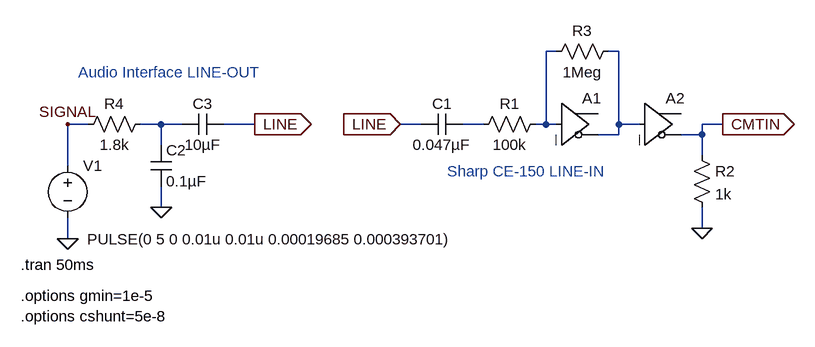
[diagram p0: schematic cd150-line-in_via_sig_gen.asc]
cd150-line-in_via_sig_gen.asc, the LTspice schematic file:
Version 4
SHEET 1 880 680
WIRE 320 -320 304 -320
WIRE 416 -320 400 -320
WIRE -400 -208 -432 -208
WIRE -288 -208 -320 -208
WIRE -256 -208 -288 -208
WIRE -144 -208 -192 -208
WIRE 112 -208 80 -208
WIRE 208 -208 176 -208
WIRE 304 -208 304 -320
WIRE 304 -208 288 -208
WIRE 320 -208 304 -208
WIRE 416 -208 416 -320
WIRE 448 -208 416 -208
WIRE 576 -208 544 -208
WIRE 416 -192 416 -208
WIRE 416 -192 384 -192
WIRE 544 -192 544 -208
WIRE 544 -192 512 -192
WIRE -288 -176 -288 -208
WIRE 544 -160 544 -192
WIRE -432 -144 -432 -208
WIRE -288 -80 -288 -112
WIRE 544 -48 544 -80
WIRE -432 -32 -432 -64
FLAG 576 -208 CMTIN
IOPIN 576 -208 Out
FLAG 80 -208 LINE
IOPIN 80 -208 In
FLAG -432 -32 0
FLAG -144 -208 LINE
IOPIN -144 -208 Out
FLAG 544 -48 0
FLAG -288 -80 0
FLAG -432 -208 SIGNAL
SYMBOL cap 176 -224 R90
WINDOW 0 0 32 VBottom 2
WINDOW 3 32 32 VTop 2
SYMATTR InstName C1
SYMATTR Value 0.047µF
SYMBOL res 304 -224 R90
WINDOW 0 0 56 VBottom 2
WINDOW 3 32 56 VTop 2
SYMATTR InstName R1
SYMATTR Value 100k
SYMBOL voltage -432 -160 R0
WINDOW 3 30 129 Left 2
WINDOW 123 0 0 Left 0
WINDOW 39 0 0 Left 0
SYMATTR InstName V1
SYMATTR Value PULSE(0 5 0 0.01u 0.01u 0.00019685 0.000393701)
SYMBOL Digital\\buf 320 -272 R0
SYMATTR InstName A1
SYMATTR Value2 Vhigh=5 Vlow=0 Ref=1.5
SYMBOL Digital\\buf 448 -272 R0
SYMATTR InstName A2
SYMATTR Value2 Vhigh=5 Vlow=0 Ref=1.5
SYMBOL res 528 -176 R0
SYMATTR InstName R2
SYMATTR Value 1k
SYMBOL res 416 -336 R90
WINDOW 0 0 56 VBottom 2
WINDOW 3 32 56 VTop 2
SYMATTR InstName R3
SYMATTR Value 1Meg
SYMBOL res -304 -224 R90
WINDOW 0 0 56 VBottom 2
WINDOW 3 32 56 VTop 2
SYMATTR InstName R4
SYMATTR Value 1.8k
SYMBOL cap -304 -176 R0
SYMATTR InstName C2
SYMATTR Value 0.1µF
SYMBOL cap -192 -224 R90
WINDOW 0 0 32 VBottom 2
WINDOW 3 32 32 VTop 2
SYMATTR InstName C3
SYMATTR Value 10µF
TEXT -504 8 Left 2 !.tran 50ms
TEXT -504 56 Left 2 !.options gmin=1e-5\n.options cshunt=5e-8
TEXT 152 -136 Left 2 ;Sharp CE-150 LINE-IN
TEXT -416 -288 Left 2 ;Audio Interface LINE-OUT

The netlist it stands for:
* cd150-line-in_via_sig_gen.asc
C1 N004 LINE 0.047µF
R1 N001 N004 100k
V1 SIGNAL 0 PULSE(0 5 0 0.01u 0.01u 0.00019685 0.000393701)
A1 N001 0 0 0 0 N002 0 0 BUF Vhigh=5 Vlow=0 Ref=1.5
A2 N002 0 0 0 0 CMTIN 0 0 BUF Vhigh=5 Vlow=0 Ref=1.5
R2 CMTIN 0 1k
R3 N002 N001 1Meg
R4 N003 SIGNAL 1.8k
C2 N003 0 0.1µF
C3 LINE N003 10µF
.tran 50ms
.options gmin=1e-5
.options cshunt=5e-8
* Sharp CE-150 LINE-IN
* Audio Interface LINE-OUT
.backanno
.end